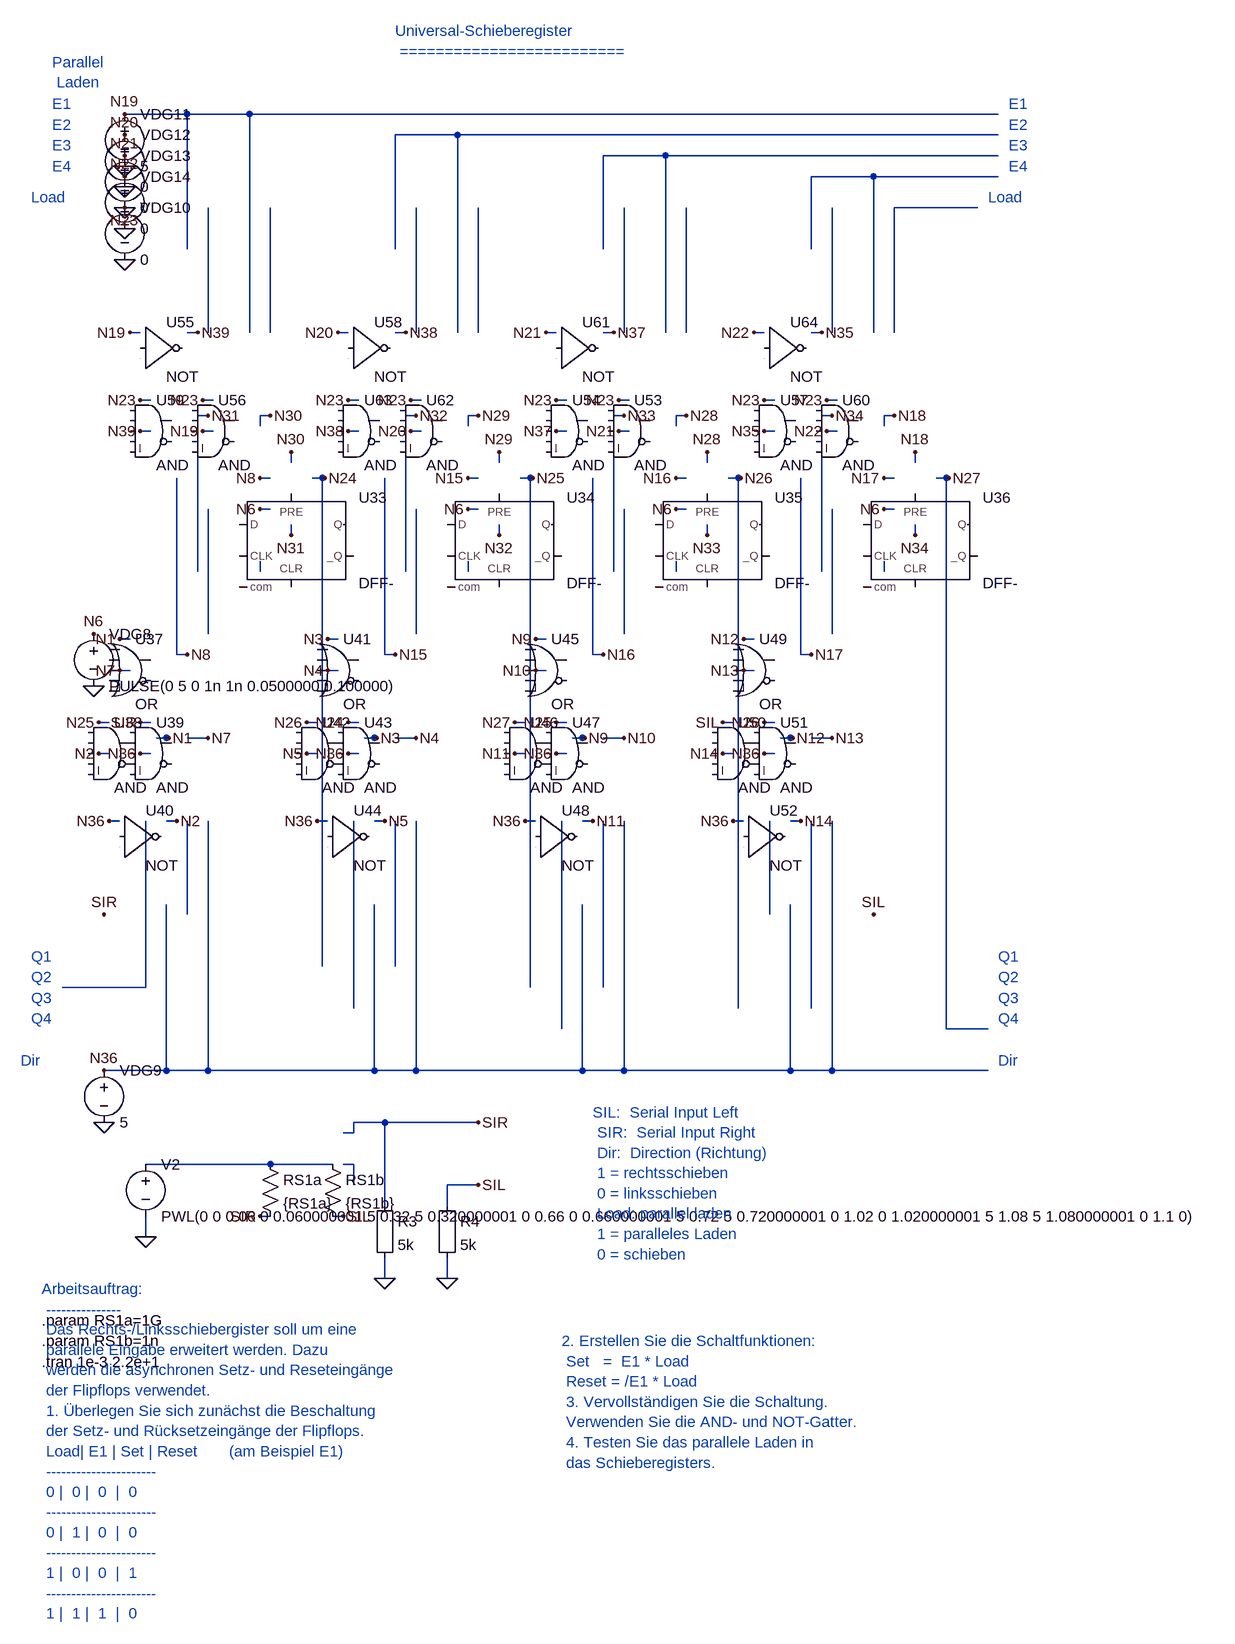
[diagram p0: schematic 6_3_3_Universal_Schieberegister_Lsg.asc]
6_3_3_Universal_Schieberegister_Lsg.asc, the LTspice schematic file:
Version 4
SHEET 1 880 680
WIRE 224 1952 224 1968
WIRE 416 1872 512 1872
WIRE 320 1056 320 864
WIRE 640 864 640 1056
WIRE 1280 864 1280 1056
WIRE 960 864 960 1056
WIRE 224 1984 224 1968
WIRE 240 1216 256 1216
WIRE 288 1216 304 1216
WIRE 272 1088 272 816
WIRE 560 1216 576 1216
WIRE 608 1216 624 1216
WIRE 880 1216 896 1216
WIRE 928 1216 944 1216
WIRE 1200 1216 1216 1216
WIRE 1248 1216 1264 1216
WIRE 592 1088 592 816
WIRE 912 1088 912 816
WIRE 1232 1088 1232 816
WIRE 1216 1728 1280 1728
WIRE 1216 1472 1216 1728
WIRE 960 1728 1216 1728
WIRE 960 1344 960 1728
WIRE 896 1728 960 1728
WIRE 896 1472 896 1728
WIRE 640 1728 896 1728
WIRE 640 1344 640 1728
WIRE 576 1728 640 1728
WIRE 576 1472 576 1728
WIRE 320 1728 576 1728
WIRE 320 1344 320 1728
WIRE 256 1472 256 1728
WIRE 288 1488 288 1344
WIRE 1184 1488 1184 1344
WIRE 1248 1344 1248 1632
WIRE 1520 1664 1456 1664
WIRE 608 1568 608 1344
WIRE 1280 1728 1280 1344
WIRE 1520 1728 1280 1728
WIRE 736 1808 592 1808
WIRE 736 1904 688 1904
WIRE 928 1344 928 1600
WIRE 592 2048 592 2016
WIRE 592 1808 544 1808
WIRE 544 1808 544 1824
WIRE 544 1824 528 1824
WIRE 592 1936 592 1808
WIRE 688 2048 688 2016
WIRE 544 1904 544 1872
WIRE 544 1872 528 1872
WIRE 688 1936 688 1904
WIRE 256 1728 320 1728
WIRE 160 1728 256 1728
WIRE 480 816 496 816
WIRE 496 816 496 1568
WIRE 800 816 816 816
WIRE 816 816 816 1600
WIRE 1120 816 1136 816
WIRE 1136 816 1136 1632
WIRE 1440 816 1456 816
WIRE 1456 816 1456 1664
WIRE 224 1600 224 1344
WIRE 96 1600 224 1600
WIRE 544 1632 544 1344
WIRE 864 1664 864 1344
WIRE 1504 400 1376 400
WIRE 1536 288 704 288
WIRE 1536 320 1024 320
WIRE 1536 352 1344 352
WIRE 416 1872 224 1872
WIRE 1360 736 1360 720
WIRE 1040 736 1040 720
WIRE 720 736 720 720
WIRE 400 736 400 720
WIRE 304 720 304 960
WIRE 400 960 400 944
WIRE 624 720 624 960
WIRE 720 960 720 944
WIRE 944 720 944 960
WIRE 1040 960 1040 944
WIRE 1264 720 1264 960
WIRE 1360 960 1360 944
WIRE 320 592 320 400
WIRE 416 592 416 400
WIRE 640 592 640 400
WIRE 736 592 736 400
WIRE 960 592 960 400
WIRE 1056 592 1056 400
WIRE 1280 592 1280 400
WIRE 1376 592 1376 400
WIRE 288 256 192 256
WIRE 288 464 288 256
WIRE 384 256 288 256
WIRE 384 592 384 256
WIRE 1536 256 384 256
WIRE 704 288 608 288
WIRE 704 592 704 288
WIRE 608 464 608 288
WIRE 928 464 928 320
WIRE 1024 320 928 320
WIRE 1024 592 1024 320
WIRE 1248 464 1248 352
WIRE 1344 352 1248 352
WIRE 1344 592 1344 352
WIRE 1376 864 1360 864
WIRE 736 864 720 864
WIRE 416 864 400 864
WIRE 1056 864 1040 864
WIRE 240 1216 260 1216
WIRE 200 1064 184 1064
WIRE 200 1112 184 1112
WIRE 304 1216 320 1216
WIRE 272 1088 288 1088
WIRE 416 816 400 816
WIRE 1128 1192 1112 1192
WIRE 512 1952 528 1952
WIRE 232 1192 216 1192
WIRE 416 1952 400 1952
WIRE 168 1240 152 1240
WIRE 256 1344 272 1344
WIRE 560 1216 580 1216
WIRE 520 1064 504 1064
WIRE 520 1112 504 1112
WIRE 624 1216 640 1216
WIRE 488 1240 472 1240
WIRE 576 1344 592 1344
WIRE 880 1216 900 1216
WIRE 840 1064 824 1064
WIRE 840 1112 824 1112
WIRE 944 1216 960 1216
WIRE 808 1240 792 1240
WIRE 896 1344 912 1344
WIRE 1200 1216 1220 1216
WIRE 1160 1064 1144 1064
WIRE 1160 1112 1144 1112
WIRE 1264 1216 1280 1216
WIRE 1128 1240 1112 1240
WIRE 1216 1344 1232 1344
WIRE 592 1088 608 1088
WIRE 736 816 720 816
WIRE 912 1088 928 1088
WIRE 1056 816 1040 816
WIRE 1232 1088 1248 1088
WIRE 1376 816 1360 816
WIRE 184 1344 168 1344
WIRE 232 1240 216 1240
WIRE 504 1344 488 1344
WIRE 552 1240 536 1240
WIRE 824 1344 808 1344
WIRE 872 1240 856 1240
WIRE 1144 1344 1128 1344
WIRE 1192 1240 1176 1240
WIRE 328 744 312 744
WIRE 216 592 200 592
WIRE 648 744 632 744
WIRE 536 592 520 592
WIRE 856 592 840 592
WIRE 968 744 952 744
WIRE 1176 592 1160 592
WIRE 1288 744 1272 744
WIRE 1192 696 1176 696
WIRE 968 696 952 696
WIRE 872 696 856 696
WIRE 648 696 632 696
WIRE 552 696 536 696
WIRE 328 696 312 696
WIRE 232 696 216 696
WIRE 1288 696 1272 696
WIRE 480 816 500 816
WIRE 552 1192 536 1192
WIRE 168 1192 152 1192
WIRE 800 816 820 816
WIRE 872 1192 856 1192
WIRE 488 1192 472 1192
WIRE 1120 816 1140 816
WIRE 1192 1192 1176 1192
WIRE 808 1192 792 1192
WIRE 1440 816 1460 816
WIRE 1408 792 1408 776
WIRE 1360 720 1376 720
WIRE 1088 792 1088 776
WIRE 1040 720 1056 720
WIRE 768 792 768 776
WIRE 720 720 736 720
WIRE 448 792 448 776
WIRE 400 720 416 720
WIRE 304 720 320 720
WIRE 448 888 448 904
WIRE 624 720 640 720
WIRE 768 888 768 904
WIRE 944 720 960 720
WIRE 1088 888 1088 904
WIRE 1264 720 1280 720
WIRE 1408 888 1408 904
WIRE 1192 744 1176 744
WIRE 1248 592 1264 592
WIRE 872 744 856 744
WIRE 928 592 944 592
WIRE 608 592 624 592
WIRE 552 744 536 744
WIRE 288 592 304 592
WIRE 232 744 216 744
FLAG 144 1136 0
FLAG 160 1808 0
FLAG 192 480 0
FLAG 192 336 0
FLAG 192 368 0
FLAG 192 400 0
FLAG 192 432 0
FLAG 224 1984 0
FLAG 592 2048 0
FLAG 688 2048 0
FLAG 1360 864 N6
FLAG 720 864 N6
FLAG 400 864 N6
FLAG 144 1056 N6
FLAG 1040 864 N6
FLAG 224 1984 0
FLAG 592 2048 0
FLAG 688 2048 0
FLAG 260 1216 N1
FLAG 184 1064 N1
FLAG 184 1112 N7
FLAG 320 1216 N7
FLAG 288 1088 N8
FLAG 400 816 N8
FLAG 736 1904 SIL
FLAG 1344 1488 SIL
FLAG 1112 1192 SIL
FLAG 528 1952 SIL
FLAG 736 1808 SIR
FLAG 160 1488 SIR
FLAG 216 1192 SIR
FLAG 400 1952 SIR
FLAG 152 1240 N2
FLAG 272 1344 N2
FLAG 580 1216 N3
FLAG 504 1064 N3
FLAG 504 1112 N4
FLAG 640 1216 N4
FLAG 472 1240 N5
FLAG 592 1344 N5
FLAG 900 1216 N9
FLAG 824 1064 N9
FLAG 824 1112 N10
FLAG 960 1216 N10
FLAG 792 1240 N11
FLAG 912 1344 N11
FLAG 1220 1216 N12
FLAG 1144 1064 N12
FLAG 1144 1112 N13
FLAG 1280 1216 N13
FLAG 1112 1240 N14
FLAG 1232 1344 N14
FLAG 608 1088 N15
FLAG 720 816 N15
FLAG 928 1088 N16
FLAG 1040 816 N16
FLAG 1248 1088 N17
FLAG 1360 816 N17
FLAG 168 1344 N36
FLAG 216 1240 N36
FLAG 488 1344 N36
FLAG 536 1240 N36
FLAG 808 1344 N36
FLAG 856 1240 N36
FLAG 1128 1344 N36
FLAG 1176 1240 N36
FLAG 160 1728 N36
FLAG 312 744 N19
FLAG 192 256 N19
FLAG 200 592 N19
FLAG 632 744 N20
FLAG 192 288 N20
FLAG 520 592 N20
FLAG 192 320 N21
FLAG 840 592 N21
FLAG 952 744 N21
FLAG 192 352 N22
FLAG 1160 592 N22
FLAG 1272 744 N22
FLAG 1176 696 N23
FLAG 952 696 N23
FLAG 856 696 N23
FLAG 632 696 N23
FLAG 536 696 N23
FLAG 312 696 N23
FLAG 192 400 N23
FLAG 216 696 N23
FLAG 1272 696 N23
FLAG 500 816 N24
FLAG 536 1192 N24
FLAG 152 1192 N25
FLAG 820 816 N25
FLAG 856 1192 N25
FLAG 472 1192 N26
FLAG 1140 816 N26
FLAG 1176 1192 N26
FLAG 792 1192 N27
FLAG 1460 816 N27
FLAG 1408 776 N18
FLAG 1376 720 N18
FLAG 1088 776 N28
FLAG 1056 720 N28
FLAG 768 776 N29
FLAG 736 720 N29
FLAG 448 776 N30
FLAG 416 720 N30
FLAG 320 720 N31
FLAG 448 904 N31
FLAG 640 720 N32
FLAG 768 904 N32
FLAG 960 720 N33
FLAG 1088 904 N33
FLAG 1280 720 N34
FLAG 1408 904 N34
FLAG 1176 744 N35
FLAG 1264 592 N35
FLAG 856 744 N37
FLAG 944 592 N37
FLAG 624 592 N38
FLAG 536 744 N38
FLAG 304 592 N39
FLAG 216 744 N39
SYMBOL Digital\dflop 448 840 R0
SYMATTR InstName U33
SYMATTR Value DFF-
SYMATTR LibreSpice kind=dff;edge=falling;async=high;vth=2.5;vhigh=5;pins=D,CLK,SET,RESET,Q,~Q
SYMBOL Digital\dflop 768 840 R0
SYMATTR InstName U34
SYMATTR Value DFF-
SYMATTR LibreSpice kind=dff;edge=falling;async=high;vth=2.5;vhigh=5;pins=D,CLK,SET,RESET,Q,~Q
SYMBOL Digital\dflop 1088 840 R0
SYMATTR InstName U35
SYMATTR Value DFF-
SYMATTR LibreSpice kind=dff;edge=falling;async=high;vth=2.5;vhigh=5;pins=D,CLK,SET,RESET,Q,~Q
SYMBOL Digital\dflop 1408 840 R0
SYMATTR InstName U36
SYMATTR Value DFF-
SYMATTR LibreSpice kind=dff;edge=falling;async=high;vth=2.5;vhigh=5;pins=D,CLK,SET,RESET,Q,~Q
SYMBOL voltage 144 1040 R0
SYMATTR InstName VDG8
SYMATTR Value PULSE(0 5 0 1n 1n 0.0500000 0.100000)
SYMBOL voltage 224 1856 R0
SYMATTR InstName V2
SYMATTR Value PWL(0 0 0.06 0 0.060000001 5 0.32 5 0.320000001 0 0.66 0 0.660000001 5 0.72 5 0.720000001 0 1.02 0 1.020000001 5 1.08 5 1.080000001 0 1.1 0)
SYMBOL Digital\or 200 1048 R0
SYMATTR InstName U37
SYMATTR Value OR
SYMATTR LibreSpice gate=or;inputs=2;vth=2.5;vhigh=5;pins=In1,In2,Out
SYMBOL Digital\and 168 1176 R0
SYMATTR InstName U38
SYMATTR Value AND
SYMATTR LibreSpice gate=and;inputs=2;vth=2.5;vhigh=5;pins=In1,In2,Out
SYMBOL Digital\and 232 1176 R0
SYMATTR InstName U39
SYMATTR Value AND
SYMATTR LibreSpice gate=and;inputs=2;vth=2.5;vhigh=5;pins=In1,In2,Out
SYMBOL Digital\inv 184 1304 R0
SYMATTR InstName U40
SYMATTR Value NOT
SYMATTR LibreSpice gate=not;inputs=1;vth=2.5;vhigh=5;pins=In1,Out
SYMBOL Digital\or 520 1048 R0
SYMATTR InstName U41
SYMATTR Value OR
SYMATTR LibreSpice gate=or;inputs=2;vth=2.5;vhigh=5;pins=In1,In2,Out
SYMBOL Digital\and 488 1176 R0
SYMATTR InstName U42
SYMATTR Value AND
SYMATTR LibreSpice gate=and;inputs=2;vth=2.5;vhigh=5;pins=In1,In2,Out
SYMBOL Digital\and 552 1176 R0
SYMATTR InstName U43
SYMATTR Value AND
SYMATTR LibreSpice gate=and;inputs=2;vth=2.5;vhigh=5;pins=In1,In2,Out
SYMBOL Digital\inv 504 1304 R0
SYMATTR InstName U44
SYMATTR Value NOT
SYMATTR LibreSpice gate=not;inputs=1;vth=2.5;vhigh=5;pins=In1,Out
SYMBOL Digital\or 840 1048 R0
SYMATTR InstName U45
SYMATTR Value OR
SYMATTR LibreSpice gate=or;inputs=2;vth=2.5;vhigh=5;pins=In1,In2,Out
SYMBOL Digital\and 808 1176 R0
SYMATTR InstName U46
SYMATTR Value AND
SYMATTR LibreSpice gate=and;inputs=2;vth=2.5;vhigh=5;pins=In1,In2,Out
SYMBOL Digital\and 872 1176 R0
SYMATTR InstName U47
SYMATTR Value AND
SYMATTR LibreSpice gate=and;inputs=2;vth=2.5;vhigh=5;pins=In1,In2,Out
SYMBOL Digital\inv 824 1304 R0
SYMATTR InstName U48
SYMATTR Value NOT
SYMATTR LibreSpice gate=not;inputs=1;vth=2.5;vhigh=5;pins=In1,Out
SYMBOL Digital\or 1160 1048 R0
SYMATTR InstName U49
SYMATTR Value OR
SYMATTR LibreSpice gate=or;inputs=2;vth=2.5;vhigh=5;pins=In1,In2,Out
SYMBOL Digital\and 1128 1176 R0
SYMATTR InstName U50
SYMATTR Value AND
SYMATTR LibreSpice gate=and;inputs=2;vth=2.5;vhigh=5;pins=In1,In2,Out
SYMBOL Digital\and 1192 1176 R0
SYMATTR InstName U51
SYMATTR Value AND
SYMATTR LibreSpice gate=and;inputs=2;vth=2.5;vhigh=5;pins=In1,In2,Out
SYMBOL Digital\inv 1144 1304 R0
SYMATTR InstName U52
SYMATTR Value NOT
SYMATTR LibreSpice gate=not;inputs=1;vth=2.5;vhigh=5;pins=In1,Out
SYMBOL voltage 160 1712 R0
SYMATTR InstName VDG9
SYMATTR Value 5
SYMBOL res 400 1856 R0
SYMATTR InstName RS1a
SYMATTR Value {RS1a}
SYMBOL res 496 1856 R0
SYMATTR InstName RS1b
SYMATTR Value {RS1b}
SYMBOL Misc\EuropeanResistor 576 1920 R0
SYMATTR InstName R3
SYMATTR Value 5k
SYMBOL Misc\EuropeanResistor 672 1920 R0
SYMATTR InstName R4
SYMATTR Value 5k
SYMBOL Digital\and 968 680 R0
SYMATTR InstName U53
SYMATTR Value AND
SYMATTR LibreSpice gate=and;inputs=2;vth=2.5;vhigh=5;pins=In1,In2,Out
SYMBOL Digital\and 872 680 R0
SYMATTR InstName U54
SYMATTR Value AND
SYMATTR LibreSpice gate=and;inputs=2;vth=2.5;vhigh=5;pins=In1,In2,Out
SYMBOL Digital\inv 216 552 R0
SYMATTR InstName U55
SYMATTR Value NOT
SYMATTR LibreSpice gate=not;inputs=1;vth=2.5;vhigh=5;pins=In1,Out
SYMBOL Digital\and 328 680 R0
SYMATTR InstName U56
SYMATTR Value AND
SYMATTR LibreSpice gate=and;inputs=2;vth=2.5;vhigh=5;pins=In1,In2,Out
SYMBOL Digital\and 1192 680 R0
SYMATTR InstName U57
SYMATTR Value AND
SYMATTR LibreSpice gate=and;inputs=2;vth=2.5;vhigh=5;pins=In1,In2,Out
SYMBOL Digital\inv 536 552 R0
SYMATTR InstName U58
SYMATTR Value NOT
SYMATTR LibreSpice gate=not;inputs=1;vth=2.5;vhigh=5;pins=In1,Out
SYMBOL Digital\and 232 680 R0
SYMATTR InstName U59
SYMATTR Value AND
SYMATTR LibreSpice gate=and;inputs=2;vth=2.5;vhigh=5;pins=In1,In2,Out
SYMBOL Digital\and 1288 680 R0
SYMATTR InstName U60
SYMATTR Value AND
SYMATTR LibreSpice gate=and;inputs=2;vth=2.5;vhigh=5;pins=In1,In2,Out
SYMBOL Digital\inv 856 552 R0
SYMATTR InstName U61
SYMATTR Value NOT
SYMATTR LibreSpice gate=not;inputs=1;vth=2.5;vhigh=5;pins=In1,Out
SYMBOL Digital\and 648 680 R0
SYMATTR InstName U62
SYMATTR Value AND
SYMATTR LibreSpice gate=and;inputs=2;vth=2.5;vhigh=5;pins=In1,In2,Out
SYMBOL Digital\and 552 680 R0
SYMATTR InstName U63
SYMATTR Value AND
SYMATTR LibreSpice gate=and;inputs=2;vth=2.5;vhigh=5;pins=In1,In2,Out
SYMBOL Digital\inv 1176 552 R0
SYMATTR InstName U64
SYMATTR Value NOT
SYMATTR LibreSpice gate=not;inputs=1;vth=2.5;vhigh=5;pins=In1,Out
SYMBOL voltage 192 384 R0
SYMATTR InstName VDG10
SYMATTR Value 0
SYMBOL voltage 192 240 R0
SYMATTR InstName VDG11
SYMATTR Value 5
SYMBOL voltage 192 272 R0
SYMATTR InstName VDG12
SYMATTR Value 0
SYMBOL voltage 192 304 R0
SYMATTR InstName VDG13
SYMATTR Value 0
SYMBOL voltage 192 336 R0
SYMATTR InstName VDG14
SYMATTR Value 0
TEXT 64 2112 Left 2 !.param RS1a=1G
TEXT 64 2144 Left 2 !.param RS1b=1n
TEXT 64 2176 Left 2 !.tran 1e-3 2.2e+1
TEXT 608 128 Left 2 ;Universal-Schieberegister \n =========================
TEXT 64 2064 Left 2 ;Arbeitsauftrag: \n --------------- \n Das Rechts-/Linksschiebergister soll um eine \n parallele Eingabe erweitert werden. Dazu \n werden die asynchronen Setz- und Reseteingänge \n der Flipflops verwendet. \n 1. Überlegen Sie sich zunächst die Beschaltung \n der Setz- und Rücksetzeingänge der Flipflops. \n Load| E1 | Set | Reset       (am Beispiel E1) \n ---------------------- \n 0 |  0 |  0  |  0 \n ---------------------- \n 0 |  1 |  0  |  0 \n ---------------------- \n 1 |  0 |  0  |  1 \n ---------------------- \n 1 |  1 |  1  |  0
TEXT 912 1792 Left 2 ;SIL:  Serial Input Left \n SIR:  Serial Input Right \n Dir:  Direction (Richtung) \n 1 = rechtsschieben \n 0 = linksschieben \n Load: parallel laden \n 1 = paralleles Laden \n 0 = schieben
TEXT 864 2144 Left 2 ;2. Erstellen Sie die Schaltfunktionen: \n Set   =  E1 * Load \n Reset = /E1 * Load \n 3. Vervollständigen Sie die Schaltung. \n Verwenden Sie die AND- und NOT-Gatter. \n 4. Testen Sie das parallele Laden in \n das Schieberegisters.
TEXT 1536 1552 Left 2 ;Q1
TEXT 1536 1584 Left 2 ;Q2
TEXT 1536 1616 Left 2 ;Q3
TEXT 1536 1648 Left 2 ;Q4
TEXT 1536 1712 Left 2 ;Dir
TEXT 80 240 Left 2 ;E1
TEXT 80 272 Left 2 ;E2
TEXT 80 304 Left 2 ;E3
TEXT 80 336 Left 2 ;E4
TEXT 48 384 Left 2 ;Load
TEXT 32 1712 Left 2 ;Dir
TEXT 1552 240 Left 2 ;E1
TEXT 1552 272 Left 2 ;E2
TEXT 1552 304 Left 2 ;E3
TEXT 1552 336 Left 2 ;E4
TEXT 1520 384 Left 2 ;Load
TEXT 80 176 Left 2 ;Parallel \n Laden
TEXT 48 1552 Left 2 ;Q1
TEXT 48 1584 Left 2 ;Q2
TEXT 48 1616 Left 2 ;Q3
TEXT 48 1648 Left 2 ;Q4

The netlist it stands for:
* 6_3_3_Universal_Schieberegister_Lsg.asc
A§U33 0 0 0 0 0 0 0 0 DFLOP DFF-
A§U34 0 0 0 0 0 0 0 0 DFLOP DFF-
A§U35 0 0 0 0 0 0 0 0 DFLOP DFF-
A§U36 0 0 0 0 0 0 0 0 DFLOP DFF-
VDG8 N6 0 PULSE(0 5 0 1n 1n 0.0500000 0.100000)
V2 N001 0 PWL(0 0 0.06 0 0.060000001 5 0.32 5 0.320000001 0 0.66 0 0.660000001 5 0.72 5 0.720000001 0 1.02 0 1.020000001 5 1.08 5 1.080000001 0 1.1 0)
A§U37 0 0 0 0 0 0 0 0 OR OR
A§U38 0 0 0 0 0 P001 P002 0 AND AND
A§U39 0 P002 0 P001 0 0 0 0 AND AND
A§U40 0 0 0 0 0 0 0 0 BUF NOT
A§U41 0 0 0 0 0 0 0 0 OR OR
A§U42 0 0 0 0 0 P003 P004 0 AND AND
A§U43 0 P004 0 P003 0 0 0 0 AND AND
A§U44 0 0 0 0 0 0 0 0 BUF NOT
A§U45 0 0 0 0 0 0 0 0 OR OR
A§U46 0 0 0 0 0 P005 P006 0 AND AND
A§U47 0 P006 0 P005 0 0 0 0 AND AND
A§U48 0 0 0 0 0 0 0 0 BUF NOT
A§U49 0 0 0 0 0 0 0 0 OR OR
A§U50 0 0 0 0 0 P007 P008 0 AND AND
A§U51 0 P008 0 P007 0 0 0 0 AND AND
A§U52 0 0 0 0 0 0 0 0 BUF NOT
VDG9 N36 0 5
RS1a N001 SIR {RS1a}
RS1b N001 SIL {RS1b}
R3 SIR 0 5k
R4 SIL 0 5k
A§U53 0 0 0 0 0 0 0 0 AND AND
A§U54 0 0 0 0 0 0 0 0 AND AND
A§U55 0 0 0 0 0 0 0 0 BUF NOT
A§U56 0 0 0 0 0 0 0 0 AND AND
A§U57 0 0 0 0 0 0 0 0 AND AND
A§U58 0 0 0 0 0 0 0 0 BUF NOT
A§U59 0 0 0 0 0 0 0 0 AND AND
A§U60 0 0 0 0 0 0 0 0 AND AND
A§U61 0 0 0 0 0 0 0 0 BUF NOT
A§U62 0 0 0 0 0 0 0 0 AND AND
A§U63 0 0 0 0 0 0 0 0 AND AND
A§U64 0 0 0 0 0 0 0 0 BUF NOT
VDG10 0 0 0
VDG11 N19 0 5
VDG12 N20 0 0
VDG13 N21 0 0
VDG14 N22 0 0
.param RS1a=1G
.param RS1b=1n
.tran 1e-3 2.2e+1
* Universal-Schieberegister
*  =========================
* Arbeitsauftrag:
*  ---------------
*  Das Rechts-/Linksschiebergister soll um eine
*  parallele Eingabe erweitert werden. Dazu
*  werden die asynchronen Setz- und Reseteingänge
*  der Flipflops verwendet.
*  1. Überlegen Sie sich zunächst die Beschaltung
*  der Setz- und Rücksetzeingänge der Flipflops.
*  Load| E1 | Set | Reset       (am Beispiel E1)
*  ----------------------
*  0 |  0 |  0  |  0
*  ----------------------
*  0 |  1 |  0  |  0
*  ----------------------
*  1 |  0 |  0  |  1
*  ----------------------
*  1 |  1 |  1  |  0
* SIL:  Serial Input Left
*  SIR:  Serial Input Right
*  Dir:  Direction (Richtung)
*  1 = rechtsschieben
*  0 = linksschieben
*  Load: parallel laden
*  1 = paralleles Laden
*  0 = schieben
* 2. Erstellen Sie die Schaltfunktionen:
*  Set   =  E1 * Load
*  Reset = /E1 * Load
*  3. Vervollständigen Sie die Schaltung.
*  Verwenden Sie die AND- und NOT-Gatter.
*  4. Testen Sie das parallele Laden in
*  das Schieberegisters.
* Q1
* Q2
* Q3
* Q4
* Dir
* E1
* E2
* E3
* E4
* Load
* Dir
* E1
* E2
* E3
* E4
* Load
* Parallel
*  Laden
* Q1
* Q2
* Q3
* Q4
.backanno
.end